# Altium schematic sheet ChristmasTree.SchDoc
size A1
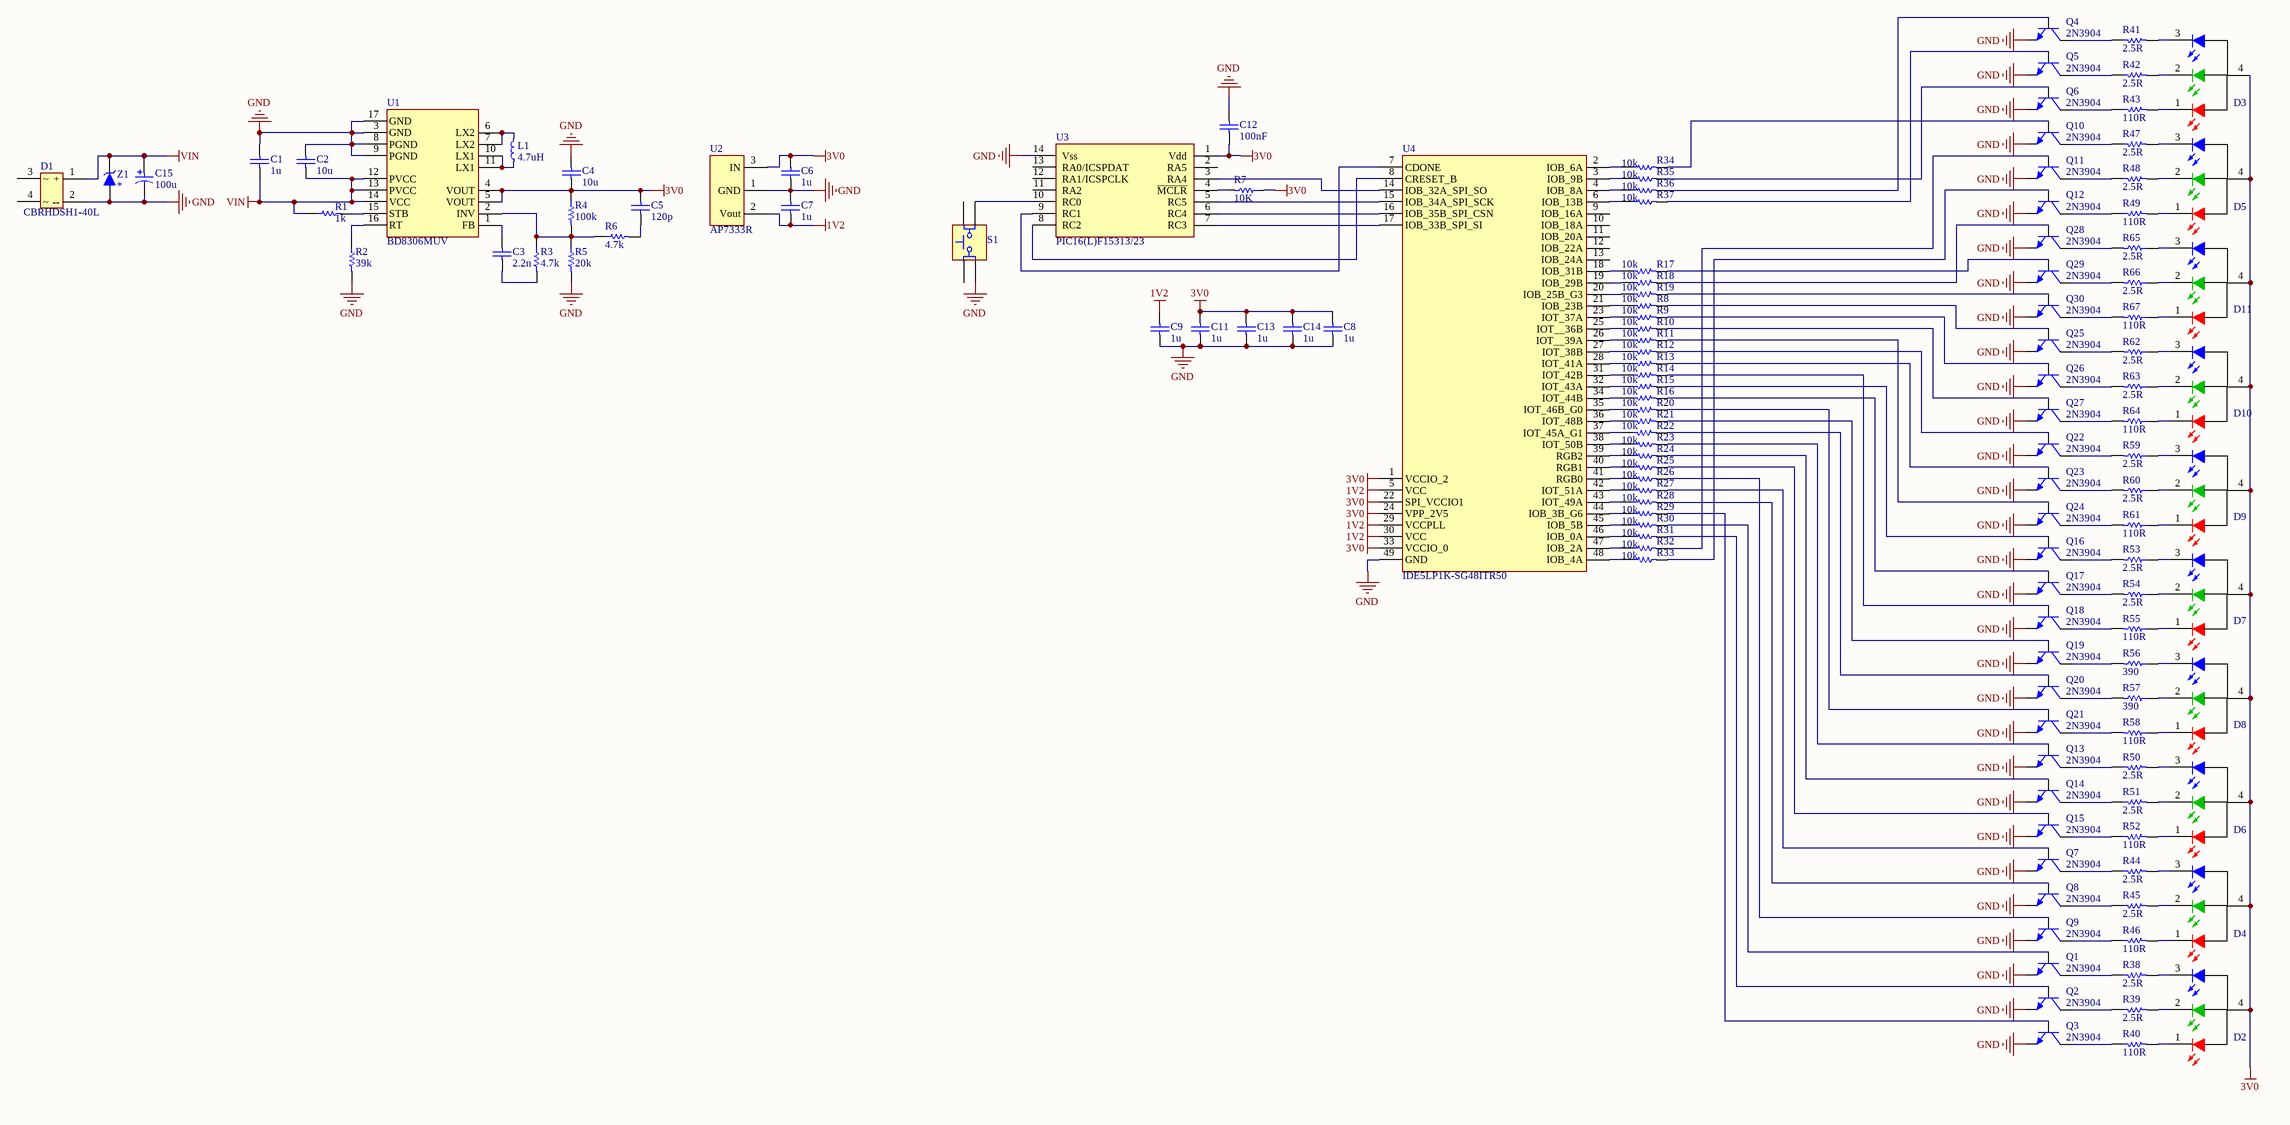
[diagram p0: ChristmasTree.SchDoc]

## Parts
C1  1u  [CAP 0603_N]
C2  10u  [CAP 0805_N]
C3  2.2n  [CAP 0603_N]
C4  10u  [CAP 0805_N]
C5  120p  [CAP 0603_N]
C6  1u  [CAP 0603_N]
C7  1u  [CAP 0603_N]
C8  1u  [CAP 0603_N]
C9  1u  [CAP 0805_N]
C11  1u  [CAP 0603_N]
C12  100nF  [CAP 0805_N]
C13  1u  [CAP 0603_N]
C14  1u  [CAP 0603_N]
C15  100u  [SMD CAP-6.3X7.7MM-A1K2]
D1  CBRHDSH1-40L  [HDDIP(Rectifier)]
D2  RGB LED Common Anode  [LED LTST-C19HE1WT]  (value not drawn)
D3  RGB LED Common Anode  [LED LTST-C19HE1WT]  (value not drawn)
D4  RGB LED Common Anode  [LED LTST-C19HE1WT]  (value not drawn)
D5  RGB LED Common Anode  [LED LTST-C19HE1WT]  (value not drawn)
D6  RGB LED Common Anode  [LED LTST-C19HE1WT]  (value not drawn)
D7  RGB LED Common Anode  [LED LTST-C19HE1WT]  (value not drawn)
D8  RGB LED Common Anode  [LED LTST-C19HE1WT]  (value not drawn)
D9  RGB LED Common Anode  [LED LTST-C19HE1WT]  (value not drawn)
D10  RGB LED Common Anode  [LED LTST-C19HE1WT]  (value not drawn)
D11  RGB LED Common Anode  [LED LTST-C19HE1WT]  (value not drawn)
L1  4.7uH  [INDC2520X12N]
Q1  2N3904  [SOT95P245X110-3N]
Q2  2N3904  [SOT95P245X110-3N]
Q3  2N3904  [SOT95P245X110-3N]
Q4  2N3904  [SOT95P245X110-3N]
Q5  2N3904  [SOT95P245X110-3N]
Q6  2N3904  [SOT95P245X110-3N]
Q7  2N3904  [SOT95P245X110-3N]
Q8  2N3904  [SOT95P245X110-3N]
Q9  2N3904  [SOT95P245X110-3N]
Q10  2N3904  [SOT95P245X110-3N]
Q11  2N3904  [SOT95P245X110-3N]
Q12  2N3904  [SOT95P245X110-3N]
Q13  2N3904  [SOT95P245X110-3N]
Q14  2N3904  [SOT95P245X110-3N]
Q15  2N3904  [SOT95P245X110-3N]
Q16  2N3904  [SOT95P245X110-3N]
Q17  2N3904  [SOT95P245X110-3N]
Q18  2N3904  [SOT95P245X110-3N]
Q19  2N3904  [SOT95P245X110-3N]
Q20  2N3904  [SOT95P245X110-3N]
Q21  2N3904  [SOT95P245X110-3N]
Q22  2N3904  [SOT95P245X110-3N]
Q23  2N3904  [SOT95P245X110-3N]
Q24  2N3904  [SOT95P245X110-3N]
Q25  2N3904  [SOT95P245X110-3N]
Q26  2N3904  [SOT95P245X110-3N]
Q27  2N3904  [SOT95P245X110-3N]
Q28  2N3904  [SOT95P245X110-3N]
Q29  2N3904  [SOT95P245X110-3N]
Q30  2N3904  [SOT95P245X110-3N]
R1  value 1k  [RES 0603_N]  (hidden comment: Res)
R2  value 39k  [RES 0603_N]  (hidden comment: Res)
R3  value 4.7k  [RES 0603_N]  (hidden comment: Res)
R4  value 100k  [RES 0603_N]  (hidden comment: Res)
R5  value 20k  [RES 0603_N]  (hidden comment: Res)
R6  value 4.7k  [RES 0603_N]  (hidden comment: Res)
R7  10K  [RES 0603_N]
R8  value 10k  [RES 0603_N]  (hidden comment: Res)
R9  value 10k  [RES 0603_N]  (hidden comment: Res)
R10  value 10k  [RES 0603_N]  (hidden comment: Res)
R11  value 10k  [RES 0603_N]  (hidden comment: Res)
R12  value 10k  [RES 0603_N]  (hidden comment: Res)
R13  value 10k  [RES 0603_N]  (hidden comment: Res)
R14  value 10k  [RES 0603_N]  (hidden comment: Res)
R15  value 10k  [RES 0603_N]  (hidden comment: Res)
R16  value 10k  [RES 0603_N]  (hidden comment: Res)
R17  value 10k  [RES 0603_N]  (hidden comment: Res)
R18  value 10k  [RES 0603_N]  (hidden comment: Res)
R19  value 10k  [RES 0603_N]  (hidden comment: Res)
R20  value 10k  [RES 0603_N]  (hidden comment: Res)
R21  value 10k  [RES 0603_N]  (hidden comment: Res)
R22  value 10k  [RES 0603_N]  (hidden comment: Res)
R23  value 10k  [RES 0603_N]  (hidden comment: Res)
R24  value 10k  [RES 0603_N]  (hidden comment: Res)
R25  value 10k  [RES 0603_N]  (hidden comment: Res)
R26  value 10k  [RES 0603_N]  (hidden comment: Res)
R27  value 10k  [RES 0603_N]  (hidden comment: Res)
R28  value 10k  [RES 0603_N]  (hidden comment: Res)
R29  value 10k  [RES 0603_N]  (hidden comment: Res)
R30  value 10k  [RES 0603_N]  (hidden comment: Res)
R31  value 10k  [RES 0603_N]  (hidden comment: Res)
R32  value 10k  [RES 0603_N]  (hidden comment: Res)
R33  value 10k  [RES 0603_N]  (hidden comment: Res)
R34  value 10k  [RES 0603_N]  (hidden comment: Res)
R35  value 10k  [RES 0603_N]  (hidden comment: Res)
R36  value 10k  [RES 0603_N]  (hidden comment: Res)
R37  value 10k  [RES 0603_N]  (hidden comment: Res)
R38  value 2.5R  [RES 0603_N]  (hidden comment: Res)
R39  value 2.5R  [RES 0603_N]  (hidden comment: Res)
R40  value 110R  [RES 0603_N]  (hidden comment: Res)
R41  value 2.5R  [RES 0603_N]  (hidden comment: Res)
R42  value 2.5R  [RES 0603_N]  (hidden comment: Res)
R43  value 110R  [RES 0603_N]  (hidden comment: Res)
R44  value 2.5R  [RES 0603_N]  (hidden comment: Res)
R45  value 2.5R  [RES 0603_N]  (hidden comment: Res)
R46  value 110R  [RES 0603_N]  (hidden comment: Res)
R47  value 2.5R  [RES 0603_N]  (hidden comment: Res)
R48  value 2.5R  [RES 0603_N]  (hidden comment: Res)
R49  value 110R  [RES 0603_N]  (hidden comment: Res)
R50  value 2.5R  [RES 0603_N]  (hidden comment: Res)
R51  value 2.5R  [RES 0603_N]  (hidden comment: Res)
R52  value 110R  [RES 0603_N]  (hidden comment: Res)
R53  value 2.5R  [RES 0603_N]  (hidden comment: Res)
R54  value 2.5R  [RES 0603_N]  (hidden comment: Res)
R55  value 110R  [RES 0603_N]  (hidden comment: Res)
R56  value 390  [RES 0603_N]  (hidden comment: Res)
R57  value 390  [RES 0603_N]  (hidden comment: Res)
R58  value 110R  [RES 0603_N]  (hidden comment: Res)
R59  value 2.5R  [RES 0603_N]  (hidden comment: Res)
R60  value 2.5R  [RES 0603_N]  (hidden comment: Res)
R61  value 110R  [RES 0603_N]  (hidden comment: Res)
R62  value 2.5R  [RES 0603_N]  (hidden comment: Res)
R63  value 2.5R  [RES 0603_N]  (hidden comment: Res)
R64  value 110R  [RES 0603_N]  (hidden comment: Res)
R65  value 2.5R  [RES 0603_N]  (hidden comment: Res)
R66  value 2.5R  [RES 0603_N]  (hidden comment: Res)
R67  value 110R  [RES 0603_N]  (hidden comment: Res)
S1  SW Tactile  [SW-TACT-SMD-6060]  (value not drawn)
U1  BD8306MUV  [QFN50P300X300X100_HS-17N]
U2  AP7333R  [SOT95P245X110-3N]
U3  PIC16(L)F15313/23  [SOIC14]
U4  IDE5LP1K-SG48ITR50  [QFN50P700X700X85_HS-49M]
Z1  *  [SOD-123-K1A2]

## Nets
1V2: C7.2 C9.1 U2.2(Vout) U4.5(VCC) U4.29(VCCPLL) U4.30(VCC)
3V0: C4.2 C5.2 C6.1 C8.1 C11.1 C12.1 C13.1 C14.1 D2.4(A) D3.4(A) D4.4(A) D5.4(A) D6.4(A) D7.4(A) D8.4(A) D9.4(A) D10.4(A) D11.4(A) R4.1 R7.1 U1.4(VOUT) U1.5(VOUT) U2.3(IN) U3.1(Vdd) U4.1(VCCIO_2) U4.22(SPI_VCCIO1) U4.24(VPP_2V5) U4.33(VCCIO_0)
GND: C1.2 C2.2 C4.1 C6.2 C7.1 C8.2 C9.2 C11.2 C12.2 C13.2 C14.2 C15.2(K) D1.2(--) Q1.2(E) Q2.2(E) Q3.2(E) Q4.2(E) Q5.2(E) Q6.2(E) Q7.2(E) Q8.2(E) Q9.2(E) Q10.2(E) Q11.2(E) Q12.2(E) Q13.2(E) Q14.2(E) Q15.2(E) Q16.2(E) Q17.2(E) Q18.2(E) Q19.2(E) Q20.2(E) Q21.2(E) Q22.2(E) Q23.2(E) Q24.2(E) Q25.2(E) Q26.2(E) Q27.2(E) Q28.2(E) Q29.2(E) Q30.2(E) R2.2 R5.2 S1.2 U1.3(GND) U1.8(PGND) U1.9(PGND) U1.17(GND) U2.1(GND) U3.14(Vss) U4.49(GND) Z1.2(A)
VIN: C1.1 C2.1 C15.1(A) D1.1(+) R1.1 U1.12(PVCC) U1.13(PVCC) U1.14(VCC) Z1.1(K)
NetC3_1: C3.1 R3.2
NetC3_2: C3.2 U1.1(FB)
NetC5_1: C5.1 R6.2
NetD2_1: D2.1(K) R40.2
NetD2_2: D2.2(K) R39.2
NetD2_3: D2.3(K) R38.2
NetD3_1: D3.1(K) R43.2
NetD3_2: D3.2(K) R42.2
NetD3_3: D3.3(K) R41.2
NetD4_1: D4.1(K) R46.2
NetD4_2: D4.2(K) R45.2
NetD4_3: D4.3(K) R44.2
NetD5_1: D5.1(K) R49.2
NetD5_2: D5.2(K) R48.2
NetD5_3: D5.3(K) R47.2
NetD6_1: D6.1(K) R52.2
NetD6_2: D6.2(K) R51.2
NetD6_3: D6.3(K) R50.2
NetD7_1: D7.1(K) R55.1
NetD7_2: D7.2(K) R54.1
NetD7_3: D7.3(K) R53.1
NetD8_1: D8.1(K) R58.1
NetD8_2: D8.2(K) R57.1
NetD8_3: D8.3(K) R56.1
NetD9_1: D9.1(K) R61.1
NetD9_2: D9.2(K) R60.1
NetD9_3: D9.3(K) R59.1
NetD10_1: D10.1(K) R64.1
NetD10_2: D10.2(K) R63.1
NetD10_3: D10.3(K) R62.1
NetD11_1: D11.1(K) R67.1
NetD11_2: D11.2(K) R66.1
NetD11_3: D11.3(K) R65.1
NetL1_1: L1.1 U1.10(LX1) U1.11(LX1)
NetL1_2: L1.2 U1.6(LX2) U1.7(LX2)
NetQ1_1: Q1.1(B) R30.2
NetQ1_3: Q1.3(C) R38.1
NetQ2_1: Q2.1(B) R31.2
NetQ2_3: Q2.3(C) R39.1
NetQ3_1: Q3.1(B) R29.2
NetQ3_3: Q3.3(C) R40.1
NetQ4_1: Q4.1(B) R36.2
NetQ4_3: Q4.3(C) R41.1
NetQ5_1: Q5.1(B) R37.2
NetQ5_3: Q5.3(C) R42.1
NetQ6_1: Q6.1(B) R35.2
NetQ6_3: Q6.3(C) R43.1
NetQ7_1: Q7.1(B) R27.2
NetQ7_3: Q7.3(C) R44.1
NetQ8_1: Q8.1(B) R28.2
NetQ8_3: Q8.3(C) R45.1
NetQ9_1: Q9.1(B) R26.2
NetQ9_3: Q9.3(C) R46.1
NetQ10_1: Q10.1(B) R34.2
NetQ10_3: Q10.3(C) R47.1
NetQ11_1: Q11.1(B) R32.2
NetQ11_3: Q11.3(C) R48.1
NetQ12_1: Q12.1(B) R33.2
NetQ12_3: Q12.3(C) R49.1
NetQ13_1: Q13.1(B) R23.2
NetQ13_3: Q13.3(C) R50.1
NetQ14_1: Q14.1(B) R24.2
NetQ14_3: Q14.3(C) R51.1
NetQ15_1: Q15.1(B) R25.2
NetQ15_3: Q15.3(C) R52.1
NetQ16_1: Q16.1(B) R15.2
NetQ16_3: Q16.3(C) R53.2
NetQ17_1: Q17.1(B) R16.2
NetQ17_3: Q17.3(C) R54.2
NetQ18_1: Q18.1(B) R14.2
NetQ18_3: Q18.3(C) R55.2
NetQ19_1: Q19.1(B) R21.2
NetQ19_3: Q19.3(C) R56.2
NetQ20_1: Q20.1(B) R22.2
NetQ20_3: Q20.3(C) R57.2
NetQ21_1: Q21.1(B) R20.2
NetQ21_3: Q21.3(C) R58.2
NetQ22_1: Q22.1(B) R12.2
NetQ22_3: Q22.3(C) R59.2
NetQ23_1: Q23.1(B) R13.2
NetQ23_3: Q23.3(C) R60.2
NetQ24_1: Q24.1(B) R11.2
NetQ24_3: Q24.3(C) R61.2
NetQ25_1: Q25.1(B) R8.2
NetQ25_3: Q25.3(C) R62.2
NetQ26_1: Q26.1(B) R9.2
NetQ26_3: Q26.3(C) R63.2
NetQ27_1: Q27.1(B) R10.2
NetQ27_3: Q27.3(C) R64.2
NetQ28_1: Q28.1(B) R18.2
NetQ28_3: Q28.3(C) R65.2
NetQ29_1: Q29.1(B) R17.2
NetQ29_3: Q29.3(C) R66.2
NetQ30_1: Q30.1(B) R19.2
NetQ30_3: Q30.3(C) R67.2
NetR1_2: R1.2 U1.15(STB)
NetR2_1: R2.1 U1.16(RT)
NetR3_1: R3.1 R4.2 R5.1 R6.1 U1.2(INV)
NetR7_2: R7.2 U3.4(~{MCLR})
NetR8_1: R8.1 U4.21(IOB_23B)
NetR9_1: R9.1 U4.23(IOT_37A)
NetR10_1: R10.1 U4.25(IOT__36B)
NetR11_1: R11.1 U4.26(IOT__39A)
NetR12_1: R12.1 U4.27(IOT_38B)
NetR13_1: R13.1 U4.28(IOT_41A)
NetR14_1: R14.1 U4.31(IOT_42B)
NetR15_1: R15.1 U4.32(IOT_43A)
NetR16_1: R16.1 U4.34(IOT_44B)
NetR17_1: R17.1 U4.18(IOB_31B)
NetR18_1: R18.1 U4.19(IOB_29B)
NetR19_1: R19.1 U4.20(IOB_25B_G3)
NetR20_1: R20.1 U4.35(IOT_46B_G0)
NetR21_1: R21.1 U4.36(IOT_48B)
NetR22_1: R22.1 U4.37(IOT_45A_G1)
NetR23_1: R23.1 U4.38(IOT_50B)
NetR24_1: R24.1 U4.39(RGB2)
NetR25_1: R25.1 U4.40(RGB1)
NetR26_1: R26.1 U4.41(RGB0)
NetR27_1: R27.1 U4.42(IOT_51A)
NetR28_1: R28.1 U4.43(IOT_49A)
NetR29_1: R29.1 U4.44(IOB_3B_G6)
NetR30_1: R30.1 U4.45(IOB_5B)
NetR31_1: R31.1 U4.46(IOB_0A)
NetR32_1: R32.1 U4.47(IOB_2A)
NetR33_1: R33.1 U4.48(IOB_4A)
NetR34_1: R34.1 U4.2(IOB_6A)
NetR35_1: R35.1 U4.3(IOB_9B)
NetR36_1: R36.1 U4.4(IOB_8A)
NetR37_1: R37.1 U4.6(IOB_13B)
NetS1_4: S1.4 U3.10(RC0)
NetU3_3: U3.3(RA4) U4.14(IOB_32A_SPI_SO)
NetU3_5: U3.5(RC5) U4.15(IOB_34A_SPI_SCK)
NetU3_6: U3.6(RC4) U4.16(IOB_35B_SPI_CSN)
NetU3_7: U3.7(RC3) U4.17(IOB_33B_SPI_SI)
NetU3_8: U3.8(RC2) U4.8(CRESET_B)
NetU3_9: U3.9(RC1) U4.7(CDONE)

Not connected (* = marked no-connect by the designer): D1 3(~) 4(~); S1 1 3; U3 2(RA5) 11(RA2) 12(RA1/ICSPCLK) 13(RA0/ICSPDAT); U4 9(IOB_16A) 10(IOB_18A) 11(IOB_20A) 12(IOB_22A) 13(IOB_24A)

## Library data of the parts
C1-C9 C11-C14 = -Cap Non-Pol: CAP, CER; Voltage: *
  C1 C6-C9 C11 C13 C14: Value: 1u
  C2 C4: Value: 10u
  C3: Value: 2.2n
  C5: Value: 120p
  C12: Value: 100nF
C15 = -Cap Aluminum: CAP, ALUM, A1K2; Voltage: *; ESR: *; Value: 100u
L1 = -Inductor: IND; Irms: *; Isat: *; Value: 4.7uH
Q1-Q30 = 2N3904: NPN General Purpose Amplifier; Published: 8-Jun-2000; LatestRevisionDate: 15-Jan-2003; LatestRevisionNote: PCB Footprint 'BCY-W3/D4.7' replaced; DatasheetVersion: 1997; PackageVersion: Sep-1998; PackageReference: TO-92A; Publisher: Altium Limited; PackageDescription: TO, Flat Index; 3 In-Line, Axial Leads; Body Dia. 4.5mm; Leads 0.51 x 0.48 mm (max); ComponentLink1Description: Manufacturer Link; ComponentLink1URL: http://www.fairchildsemi.com/; ComponentLink2Description: Datasheet; ComponentLink2URL: http://www.fairchildsemi.com/ds/2N%2F2N3904.pdf
R1-R6 R8-R67 = Res: Resistor; Published: 8-Jun-2000; LatestRevisionDate: 17-Jul-2002; LatestRevisionNote: Re-released for DXP Platform.; PackageReference: AXIAL-0.3; Publisher: Altium Limited; PackageDescription: Axial Device, Thru-Hole; 2 Leads; 0.3 in Pin Spacing
R7 = -Resistor: RES, SMD; Value: 10K
S1 = SW-NO (PTS645SM43SMTR 92 LFS): SPST, Normally Open, Push Button; Label: *; Value: PTS645SM43SMTR 92 LFS; Supplier 1: Digi-Key; Supplier Part Number 1: CKN9112CT-ND
Z1 = -Diode Zener K1A2: 2 Pin Zener K1A2; Value: *